# Altium schematic sheet Relay.SchDoc: <?>
size 420 x 297 mm; ApprovedBy: <?>; CheckedBy: <?>; CompanyName: ISON IMPORT-EXPORT COMPANY LIMITED; DrawnBy: <?>; DocumentNumber: <?>; Revision: <?>; SheetNumber: <?>; SheetTotal: <?>; Size: A3; ISON_Model: <?>
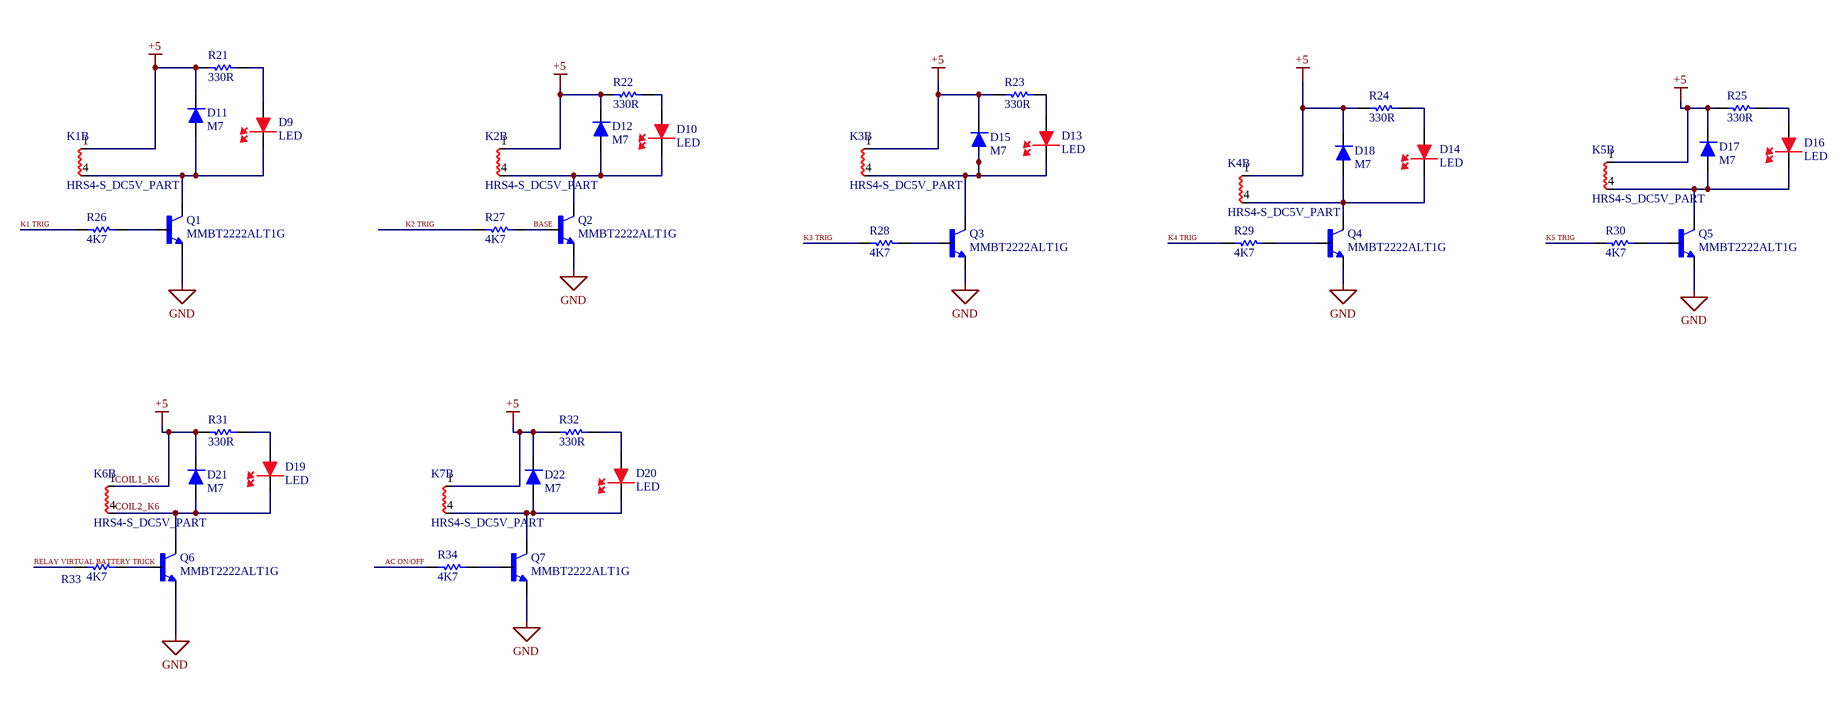
[diagram p0: Relay.SchDoc]

## Parts
D9  LED  [0805 (1205) LED]
D10  LED  [0805 (1205) LED]
D11  M7  [DO-214AC]
D12  M7  [DO-214AC]
D13  LED  [0805 (1205) LED]
D14  LED  [0805 (1205) LED]
D15  M7  [DO-214AC]
D16  LED  [0805 (1205) LED]
D17  M7  [DO-214AC]
D18  M7  [DO-214AC]
D19  LED  [0805 (1205) LED]
D20  LED  [0805 (1205) LED]
D21  M7  [DO-214AC]
D22  M7  [DO-214AC]
K1  HRS4-S_DC5V_PART  [HRS4SDC5V]  (part B of 2)
K2  HRS4-S_DC5V_PART  [HRS4SDC5V]  (part B of 2)
K3  HRS4-S_DC5V_PART  [HRS4SDC5V]  (part B of 2)
K4  HRS4-S_DC5V_PART  [HRS4SDC5V]  (part B of 2)
K5  HRS4-S_DC5V_PART  [HRS4SDC5V]  (part B of 2)
K6  HRS4-S_DC5V_PART  [HRS4SDC5V]  (part B of 2)
K7  HRS4-S_DC5V_PART  [HRS4SDC5V]  (part B of 2)
Q1  MMBT2222ALT1G  [SOT95P237X111-3N]
Q2  MMBT2222ALT1G  [SOT95P237X111-3N]
Q3  MMBT2222ALT1G  [SOT95P237X111-3N]
Q4  MMBT2222ALT1G  [SOT95P237X111-3N]
Q5  MMBT2222ALT1G  [SOT95P237X111-3N]
Q6  MMBT2222ALT1G  [SOT95P237X111-3N]
Q7  MMBT2222ALT1G  [SOT95P237X111-3N]
R21  330R  [0805 Modificado]
R22  330R  [0805 Modificado]
R23  330R  [0805 Modificado]
R24  330R  [0805 Modificado]
R25  330R  [0805 Modificado]
R26  4K7  [0805 Modificado]
R27  4K7  [0805 Modificado]
R28  4K7  [0805 Modificado]
R29  4K7  [0805 Modificado]
R30  4K7  [0805 Modificado]
R31  330R  [0805 Modificado]
R32  330R  [0805 Modificado]
R33  4K7  [0805 Modificado]
R34  4K7  [0805 Modificado]

## Nets
COIL1_K6: D11.K D12.K D15.K D17.K D18.K D21.K D22.K K1.1(COIL_1) K2.1(COIL_1) K3.1(COIL_1) K4.1(COIL_1) K5.1(COIL_1) K6.1(COIL_1) K7.1(COIL_1) R21.2 R22.2 R23.2 R24.2 R25.2 R31.2 R32.2  [also labelled +5]
GND: Q1.2(E) Q2.2(E) Q3.2(E) Q4.2(E) Q5.2(E) Q6.2(E) Q7.2(E)
AC ON/OFF: R34.2
BASE: Q2.1(B) R27.1
COIL2_K6: D19.1(K) D21.A K6.4(COIL_2) Q6.3(C)
K1 TRIG: R26.2
K2 TRIG: R27.2
K3 TRIG: R28.2
K4 TRIG: R29.2
K5 TRIG: R30.2
RELAY VIRTUAL BATTERY TRICK: R33.2
NetD9_1: D9.1(K) D11.A K1.4(COIL_2) Q1.3(C)
NetD9_2: D9.2(A) R21.1
NetD10_1: D10.1(K) D12.A K2.4(COIL_2) Q2.3(C)
NetD10_2: D10.2(A) R22.1
NetD13_1: D13.1(K) D15.A K3.4(COIL_2) Q3.3(C)
NetD13_2: D13.2(A) R23.1
NetD14_1: D14.1(K) D18.A K4.4(COIL_2) Q4.3(C)
NetD14_2: D14.2(A) R24.1
NetD16_1: D16.1(K) D17.A K5.4(COIL_2) Q5.3(C)
NetD16_2: D16.2(A) R25.1
NetD19_2: D19.2(A) R31.1
NetD20_1: D20.1(K) D22.A K7.4(COIL_2) Q7.3(C)
NetD20_2: D20.2(A) R32.1
NetQ1_1: Q1.1(B) R26.1
NetQ3_1: Q3.1(B) R28.1
NetQ4_1: Q4.1(B) R29.1
NetQ5_1: Q5.1(B) R30.1
NetQ6_1: Q6.1(B) R33.1
NetQ7_1: Q7.1(B) R34.1

## Notes on the sheet
- Modify 1:
- DWG No:
- Model:
- SHEET:
- Modify 2:
- ORIGINAL:
- Revision:
- Date:
- Draw By:
- Size:
- File:
- Approve By:
- TOTAL:
- Modify 3:

## Library data of the parts
D9 D10 D13 D14 D16 D19 D20 = LED RED (SMD): LED SMD  mcd,Red Color Red Diffused Lens
D11 D12 D15 D17 D18 D21 D22 = Diode M7: M7 Rectifier Diode 1000V/1A . Package  DO-214AC (SMA); Published: 8-Jun-2000; LatestRevisionDate: 17-Jul-2002; LatestRevisionNote: Re-released for DXP Platform.; DatasheetVersion: 1998; PackageVersion: Aug-1999; PackageReference: DO-41; Publisher: Altium Limited; PackageDescription: Diode, Axial; Body 5.2 x 2.7 mm (LxDia. max), Lead Dia. 0.86 mm (max); Code_JEDEC: DO-204-AL; ComponentLink1Description: Manufacturer Link; ComponentLink1URL: http://www.fairchildsemi.com/; ComponentLink2Description: Datasheet; ComponentLink2URL: http://www.fairchildsemi.com/ds/1N%2F1N4001.pdf
K1-K7 = HRS4-S_DC5V_PART: Relay or Contactor; Manufacturer_Name: MULTICOMP; Manufacturer_Part_Number: HRS4-S DC5V; Datasheet Link: http://www.farnell.com/datasheets/1306711.pdf; Height: 16mm
Q1-Q7 = MMBT2222ALT1G: Bipolar (BJT) Transistor NPN 40 V 600 mA 300MHz 225 mW Surface Mount SOT-23-3 (TO-236); MF: ON Semiconductor; SnapEDA_Link: https://www.snapeda.com/parts/MMBT2222ALT1G/Onsemi/view-part/?ref=snap; Purchase-URL: https://pricing.snapeda.com/search/part/MMBT2222ALT1G/?ref=eda; MP: MMBT2222ALT1G; Check_prices: https://www.snapeda.com/parts/MMBT2222ALT1G/Onsemi/view-part/?ref=eda; Availability: In Stock; Package: SOT-23-3 ON Semiconductor; Price: None; Value: *
R21-R32 = Resistor SMD 330R +/- 1% (CHIP): 'RES SMD 330 OHM 5% 1/8W 0805/0805W8F3300T5E; RMPN: RMELCRSTS010
R33 = Resistor SMD 330R +/- 1% (CHIP): 'RES SMD 4700 OHM 5% 1/8W 0805/0805W8F3300T5E; RMPN: RMELCRSTS010
R34 = Resistor SMD 330R +/- 1% (CHIP): 'RES SMD 4K7 5% 1/8W 0805/0805W8F3300T5E; RMPN: RMELCRSTS010